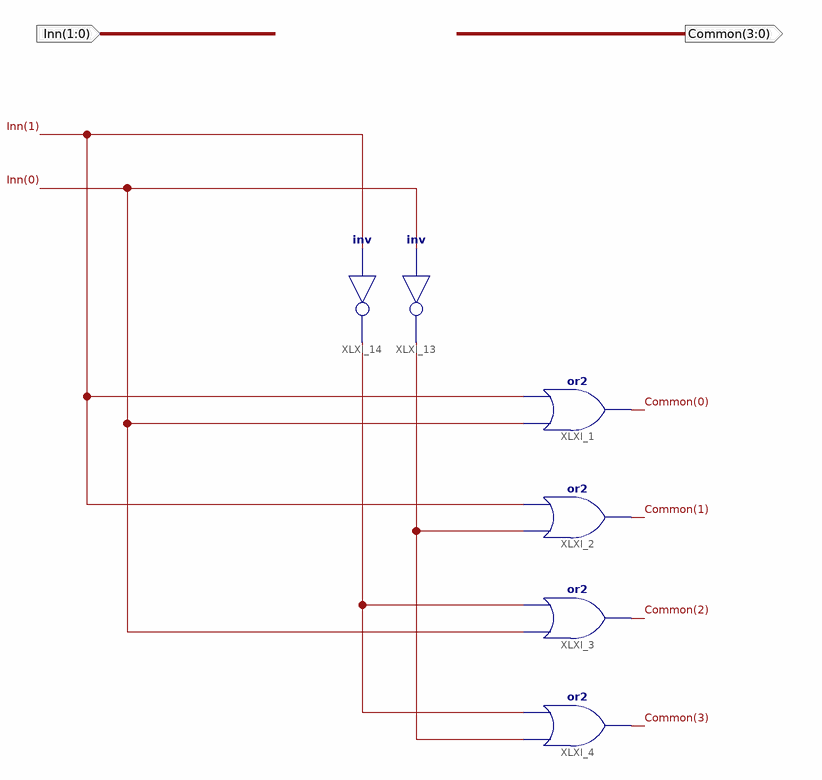
[diagram p0: schematic sheet 1]
// Xilinx ISE schematic Decoder2to4.sch (spartan6) as structural Verilog: 6 symbols, 2 ports
module Decoder2to4 (
  input  [1:0] Inn,
  output [3:0] Common
);

  wire XLXN_4, XLXN_5;

  or XLXI_1 (Common[0], Inn[0], Inn[1]);
  or XLXI_2 (Common[1], XLXN_4, Inn[1]);
  or XLXI_3 (Common[2], Inn[0], XLXN_5);
  or XLXI_4 (Common[3], XLXN_4, XLXN_5);
  not XLXI_14 (XLXN_5, Inn[1]);
  not XLXI_13 (XLXN_4, Inn[0]);
endmodule
